# Altium project PCB_Project1.PrjPCB
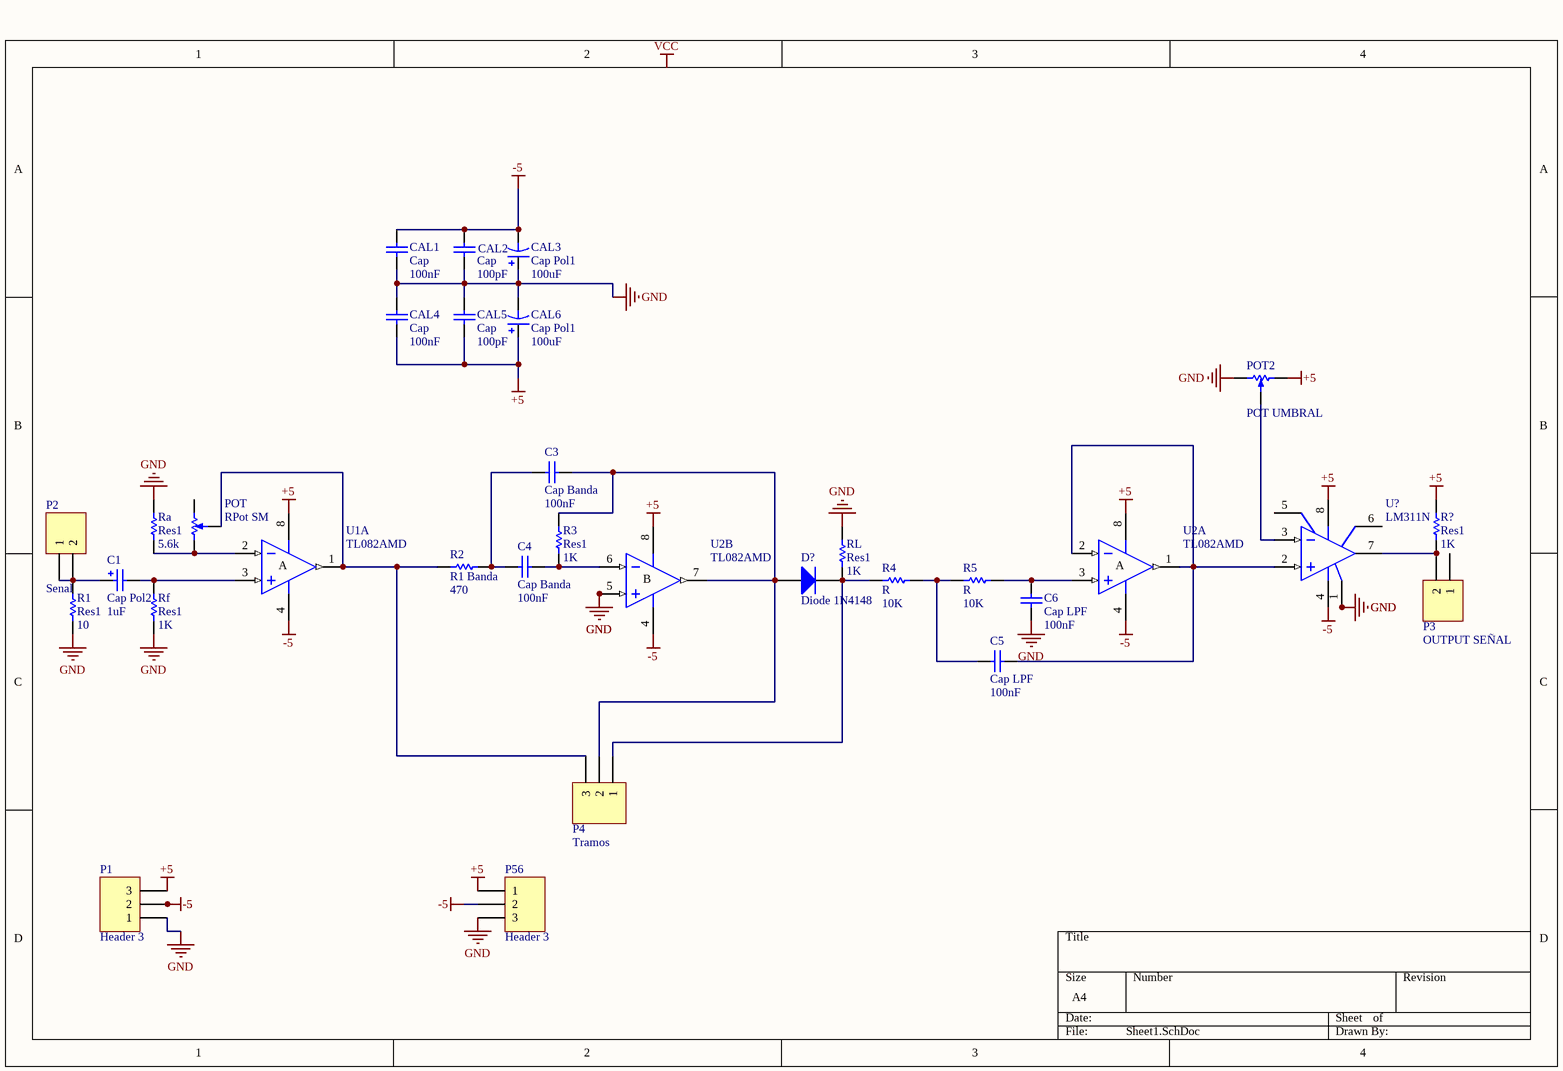
[diagram p0: Sheet1.SchDoc]
1 sheet, 31 parts. Net scope: global (net labels, ports and power ports of the same name join across sheets).
Board files: PCB A4.PcbDoc, PCB1.PcbDoc, PCB2.PcbDoc, PCB4.PcbDoc, PCB5.PcbDoc

## Sheet Sheet1.SchDoc
size A4

### Parts
C1  Cap Pol2  value 1uF  [CAPR5-4X5]
C3  Cap Banda  value 100nF  [RAD-0.3]
C4  Cap Banda  value 100nF  [RAD-0.3]
C5  Cap LPF  value 100nF  [RAD-0.3]
C6  Cap LPF  value 100nF  [RAD-0.3]
CAL1  Cap  value 100nF  [RAD-0.3]
CAL2  Cap  value 100pF  [RAD-0.3]
CAL3  Cap Pol1  value 100uF  [RB7.6-15]
CAL4  Cap  value 100nF  [RAD-0.3]
CAL5  Cap  value 100pF  [RAD-0.3]
CAL6  Cap Pol1  value 100uF  [RB7.6-15]
D?  Diode 1N4148  [DO-35]
P1  Header 3  [HDR1X3]
P2  Senal  [HDR1X2]
P3  OUTPUT SEÑAL  [HDR1X2]
P4  Tramos  [HDR1X3]
P56  Header 3  [HDR1X3]
POT  RPot SM  [POT4MM-2]
POT2  POT UMBRAL  [POT4MM-2]
R1  Res1  value 10  [AXIAL-0.3]
R2  R1 Banda  value 470  [AXIAL-0.3]
R3  Res1  value 1K  [AXIAL-0.3]
R4  R  value 10K  [AXIAL-0.3]
R5  R  value 10K  [AXIAL-0.3]
R?  Res1  value 1K  [AXIAL-0.3]
Ra  Res1  value 5.6k  [AXIAL-0.3]
Rf  Res1  value 1K  [AXIAL-0.3]
RL  Res1  value 1K  [AXIAL-0.3]
U1  TL082AMD  [SO8_N]  (part A of 2)
U2  TL082AMD  [SO8_N]  (parts A,B of 2)
U?  LM311N  [DIP8]

### Nets
+5: CAL4.1 CAL5.1 CAL6.1 P1.3 P56.1 POT2.CW(+) R?.2 U1.8(V+) U2.8(V+) U?.8(V+)
-5: CAL1.2 CAL2.2 CAL3.2 P1.2 P56.2 U1.4(V-) U2.4(V-) U?.4(V-_(CASE))
GND: C6.1 CAL1.1 CAL2.1 CAL3.1 CAL4.2 CAL5.2 CAL6.2 P1.1 P56.3 POT2.CCW(-) R1.1 Ra.1 Rf.1 RL.1 U2.5(IN+) U?.1(GND)
NetC1_1: C1.1 P2.1 P2.2 R1.2
NetC1_2: C1.2 Rf.2 U1.3(IN+)
NetC3_1: C3.1 C4.1 R2.2
NetC3_2: C3.2 D?.1(A) P4.2 R3.2 U2.7(OUT)
NetC4_2: C4.2 R3.1 U2.6(IN-)
NetC5_1: C5.1 R4.2 R5.1
NetC5_2: C5.2 U2.1(OUT) U2.2(IN-) U?.2(IN+)
NetC6_2: C6.2 R5.2 U2.3(IN+)
NetD?_2: D?.2(K) P4.1 R4.1 RL.2
NetP3_2: P3.2 R?.1 U?.7(OUT)
NetP4_3: P4.3 POT.W R2.1 U1.1(OUT)
NetPOT2_W: POT2.W U?.3(IN-)
NetPOT_CCW: POT.CCW(-) Ra.2 U1.2(IN-)

Not connected (* = marked no-connect by the designer): P3 1; POT CW(+); U? 5(BAL) 6(BAL/STB)

### Notes on the sheet
- Labels drawn without touching a wire or pin: VCC
- (in symbol TL082AMD, part A) A
- (in symbol TL082AMD, part B) B

### Library data of the parts
C1 = Cap Pol2: Polarized Capacitor (Axial); Published: 8-Jun-2000; LatestRevisionDate: 17-Jul-2002; LatestRevisionNote: Re-released for DXP Platform.; PackageReference: POLAR0.8; Publisher: Altium Limited; PackageDescription: Polarized Capacitor; 2 Leads
C3-C6 CAL1 CAL2 CAL4 CAL5 = Cap: Capacitor; Published: 8-Jun-2000; LatestRevisionDate: 17-Jul-2002; LatestRevisionNote: Re-released for DXP Platform.; PackageReference: RAD-0.3; Publisher: Altium Limited; PackageDescription: Radial Cap, Thru-Hole; 2 Leads; 0.3 in Pin Spacing
CAL3 CAL6 = Cap Pol1: Polarized Capacitor (Radial); Published: 8-Jun-2000; LatestRevisionDate: 17-Jul-2002; LatestRevisionNote: Re-released for DXP Platform.; PackageReference: RB7.6-15; Publisher: Altium Limited; PackageDescription: Polarized Capacitor (Radial); 2 Leads
D? = Diode 1N4148: High Conductance Fast Diode; Published: 8-Jun-2000; LatestRevisionDate: 17-Jul-2002; LatestRevisionNote: Re-released for DXP Platform.; DatasheetVersion: 1997; PackageReference: DO-35; Publisher: Altium Limited; PackageDescription: Diode, Axial; Body 3.8 x 1.9 mm (LxDia. max), Lead Dia. 0.53 mm (max); Code_JEDEC: DO-204-AH; ComponentLink1Description: Manufacturer Link; ComponentLink1URL: http://www.fairchildsemi.com/; ComponentLink2Description: Datasheet; ComponentLink2URL: http://www.fairchildsemi.com/ds/1N%2F1N4148.pdf
P1 P4 P56 = Header 3: Header, 3-Pin; LatestRevisionDate: 17-Jul-2002; LatestRevisionNote: Re-released for DXP Platform.; Publisher: Altium Limited
P2 P3 = Header 2: Header, 2-Pin; LatestRevisionDate: 17-Jul-2002; LatestRevisionNote: Re-released for DXP Platform.; Publisher: Altium Limited
POT POT2 = RPot SM: Square Trimming Potentiometer; Published: 17-Dec-2003; DatasheetVersion: Oct-2003; PackageReference: POT4MM-2; Publisher: Altium Limited; PackageDescription: Square Trimming Potentiometer; ComponentLink1Description: Manufacturer Link; ComponentLink1URL: http://bourns.com/2/search.html
R1-R5 R? Ra Rf RL = Res1: Resistor; Published: 8-Jun-2000; LatestRevisionDate: 17-Jul-2002; LatestRevisionNote: Re-released for DXP Platform.; PackageReference: AXIAL-0.3; Publisher: Altium Limited; PackageDescription: Axial Device, Thru-Hole; 2 Leads; 0.3 in Pin Spacing
U1 U2 = TL082AMD: General-Purpose J-FET Dual Operational Amplifier; Published: 24-Aug-2001; LatestRevisionDate: 13-Apr-2006; LatestRevisionNote: IPC-7351 Footprint Added.; DatasheetVersion: Jan-1999; PackageVersion: Dec-2002; PackageReference: SO8; Publisher: Altium Limited; PackageDescription: 8-Pin Small Outline Integrated Circuit 1.27 mm Pitch; Code_JEDEC: MS-012-AA; Code_IPC: SOIC127P600-8; ComponentLink1Description: Manufacturer Link; ComponentLink1URL: http://www.st.com/; ComponentLink2Description: Datasheet; ComponentLink2URL: http://www.st.com/stonline/products/literature/ds/2300/tl082.pdf
U? = LM311N: Voltage Comparator; Published: 24-Aug-2001; LatestRevisionDate: 06-Jun-2005; LatestRevisionNote: Stylized 3D Model Added.; DatasheetVersion: Oct-1997; PackageReference: DIP8; Publisher: Altium Limited; PackageDescription: DIP; 8 Leads; Row Spacing 7.62 mm; Pitch 2.54 mm; Code_JEDEC: MO-001-AN; ComponentLink1Description: Manufacturer Link; ComponentLink1URL: http://www.st.com/; ComponentLink2Description: Datasheet; ComponentLink2URL: http://www.st.com/stonline/products/literature/ds/4848/lm211.pdf